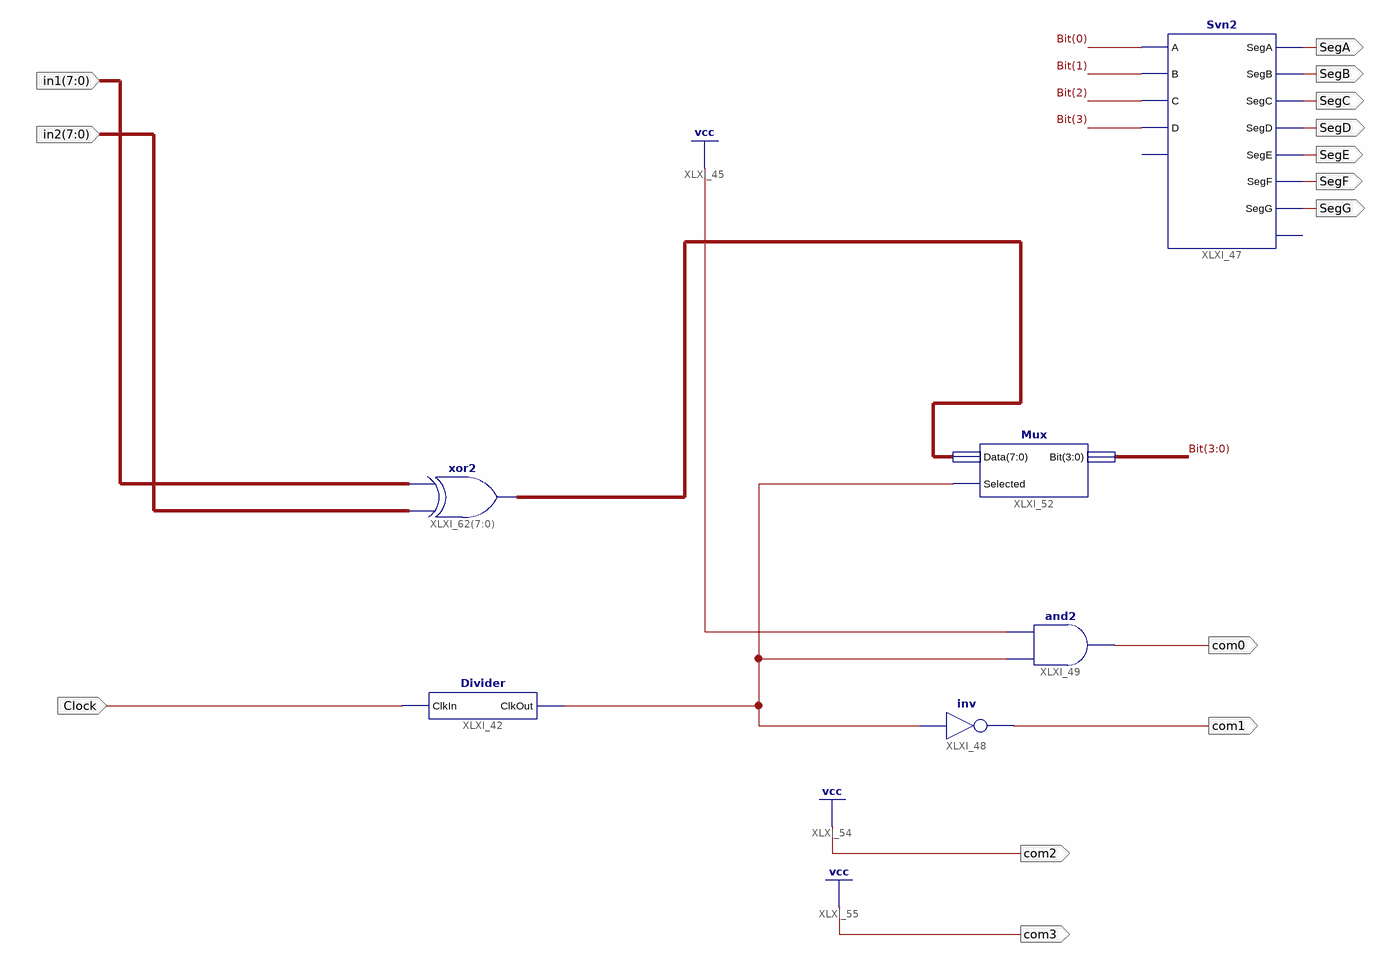
[diagram p0: schematic sheet 1]
// Xilinx ISE schematic res.sch (spartan6) as structural Verilog: 6 symbols, 14 ports
module res (
  input  Clock,
  input  [7:0] in2,
  input  [7:0] in1,
  output SegA,
  output SegB,
  output SegC,
  output SegD,
  output SegE,
  output SegF,
  output SegG,
  output com1,
  output com0,
  output com2,
  output com3
);

  wire XLXN_104;
  wire [3:0] Bit;
  wire [7:0] Data;

  Divider XLXI_42 (.ClkIn(Clock), .ClkOut(XLXN_104));
  Svn2 XLXI_47 (
    .A(Bit[0]), .B(Bit[1]), .C(Bit[2]), .D(Bit[3]), .SegA(SegA), .SegB(SegB), .SegC(SegC), .SegD(SegD),
    .SegE(SegE), .SegF(SegF), .SegG(SegG));  // open: P, SegP
  not XLXI_48 (com1, XLXN_104);
  and XLXI_49 (com0, XLXN_104, 1'b1);
  Mux XLXI_52 (.Bit(Bit), .Data(Data), .Selected(XLXN_104));
  assign Data = in2 ^ in1;  // xor2 XLXI_62[7..0], 8 bits wide

  assign com2 = 1'b1;
  assign com3 = 1'b1;
endmodule
